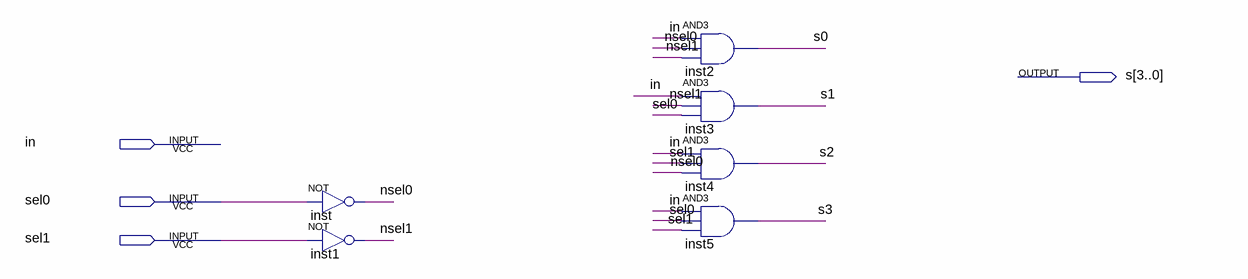
[diagram p0: schematic sheet]
// Quartus schematic demux14.bdf as structural Verilog: 6 symbols, 4 pins
module demux14 (
  input  in,
  input  sel0,
  input  sel1,
  output [3:0] s
);

  wire nsel0, nsel1;

  not inst (nsel0, sel0);
  not inst1 (nsel1, sel1);
  and inst2 (s[0], in, nsel0, nsel1);
  and inst3 (s[1], in, nsel1, sel0);
  and inst4 (s[2], in, sel1, nsel0);
  and inst5 (s[3], in, sel0, sel1);
endmodule
